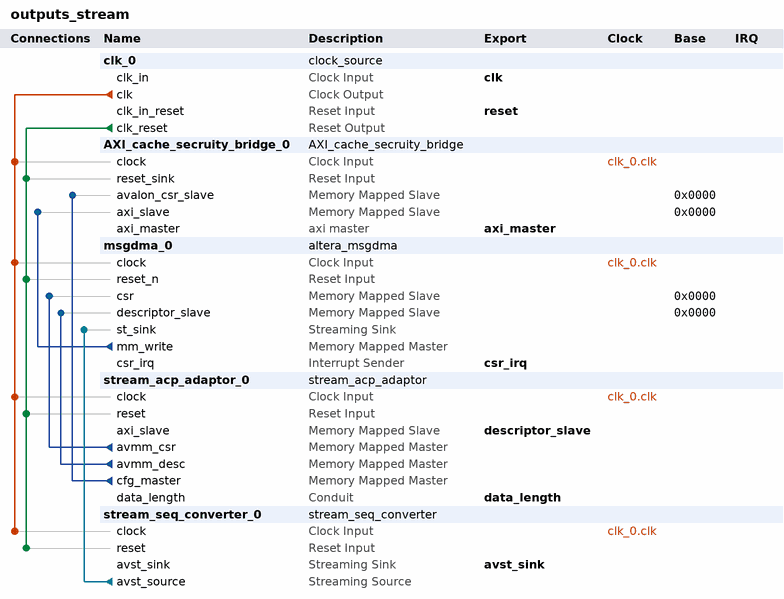
[diagram p0: system contents]
# Platform Designer (Qsys) system outputs_stream, Cyclone V 5CSEBA6U23I7
# Parameters at their usual value, and those the tool derives, are not listed.
package require -exact qsys 18.0
create_system outputs_stream
set_project_property DEVICE_FAMILY {Cyclone V}
set_project_property DEVICE 5CSEBA6U23I7

add_instance clk_0 clock_source 18.0
set_instance_parameter_value clk_0 clockFrequency 50000000

add_instance AXI_cache_secruity_bridge_0 AXI_cache_secruity_bridge 1.0
set_instance_parameter_value AXI_cache_secruity_bridge_0 ADDRESS_WIDTH 32
set_instance_parameter_value AXI_cache_secruity_bridge_0 AXUSER_WIDTH 5
set_instance_parameter_value AXI_cache_secruity_bridge_0 DATA_WIDTH 128
set_instance_parameter_value AXI_cache_secruity_bridge_0 ID_WIDTH 1

add_instance msgdma_0 altera_msgdma 18.0
set_instance_parameter_value msgdma_0 BURST_ENABLE 0
set_instance_parameter_value msgdma_0 DATA_FIFO_DEPTH 128
set_instance_parameter_value msgdma_0 DATA_WIDTH 128
set_instance_parameter_value msgdma_0 DESCRIPTOR_FIFO_DEPTH 16
set_instance_parameter_value msgdma_0 ENHANCED_FEATURES 0
set_instance_parameter_value msgdma_0 ERROR_ENABLE 0
set_instance_parameter_value msgdma_0 MAX_BURST_COUNT 2
set_instance_parameter_value msgdma_0 MAX_BYTE 1024
set_instance_parameter_value msgdma_0 MODE 2
set_instance_parameter_value msgdma_0 PACKET_ENABLE 0
set_instance_parameter_value msgdma_0 PREFETCHER_DATA_WIDTH 128
set_instance_parameter_value msgdma_0 TRANSFER_TYPE {Full Word Accesses Only}

add_instance stream_acp_adaptor_0 stream_acp_adaptor 1.0

add_instance stream_seq_converter_0 stream_seq_converter 1.0
set_instance_parameter_value stream_seq_converter_0 DATA_WIDTH 128

# connections
add_connection clk_0.clk AXI_cache_secruity_bridge_0.clock clock
add_connection clk_0.clk msgdma_0.clock clock
add_connection clk_0.clk stream_acp_adaptor_0.clock clock
add_connection clk_0.clk stream_seq_converter_0.clock clock
add_connection clk_0.clk_reset AXI_cache_secruity_bridge_0.reset_sink reset
add_connection clk_0.clk_reset msgdma_0.reset_n reset
add_connection clk_0.clk_reset stream_acp_adaptor_0.reset reset
add_connection clk_0.clk_reset stream_seq_converter_0.reset reset
add_connection msgdma_0.mm_write AXI_cache_secruity_bridge_0.axi_slave avalon
set_connection_parameter_value msgdma_0.mm_write/AXI_cache_secruity_bridge_0.axi_slave baseAddress 0x0000
add_connection stream_acp_adaptor_0.avmm_csr msgdma_0.csr avalon
set_connection_parameter_value stream_acp_adaptor_0.avmm_csr/msgdma_0.csr baseAddress 0x0000
add_connection stream_acp_adaptor_0.avmm_desc msgdma_0.descriptor_slave avalon
set_connection_parameter_value stream_acp_adaptor_0.avmm_desc/msgdma_0.descriptor_slave baseAddress 0x0000
add_connection stream_acp_adaptor_0.cfg_master AXI_cache_secruity_bridge_0.avalon_csr_slave avalon
set_connection_parameter_value stream_acp_adaptor_0.cfg_master/AXI_cache_secruity_bridge_0.avalon_csr_slave baseAddress 0x0000
add_connection stream_seq_converter_0.avst_source msgdma_0.st_sink avalon_streaming

# exported interfaces
add_interface avst_sink avalon_streaming sink
set_interface_property avst_sink EXPORT_OF stream_seq_converter_0.avst_sink
add_interface axi_master axi master
set_interface_property axi_master EXPORT_OF AXI_cache_secruity_bridge_0.axi_master
add_interface clk clock sink
set_interface_property clk EXPORT_OF clk_0.clk_in
add_interface csr_irq interrupt sender
set_interface_property csr_irq EXPORT_OF msgdma_0.csr_irq
add_interface data_length conduit end
set_interface_property data_length EXPORT_OF stream_acp_adaptor_0.data_length
add_interface descriptor_slave avalon slave
set_interface_property descriptor_slave EXPORT_OF stream_acp_adaptor_0.axi_slave
add_interface reset reset sink
set_interface_property reset EXPORT_OF clk_0.clk_in_reset

set_interconnect_requirement {$system} qsys_mm.clockCrossingAdapter HANDSHAKE
set_interconnect_requirement {$system} qsys_mm.enableEccProtection FALSE
set_interconnect_requirement {$system} qsys_mm.insertDefaultSlave FALSE
set_interconnect_requirement {$system} qsys_mm.maxAdditionalLatency 1

save_system outputs_stream.qsys
